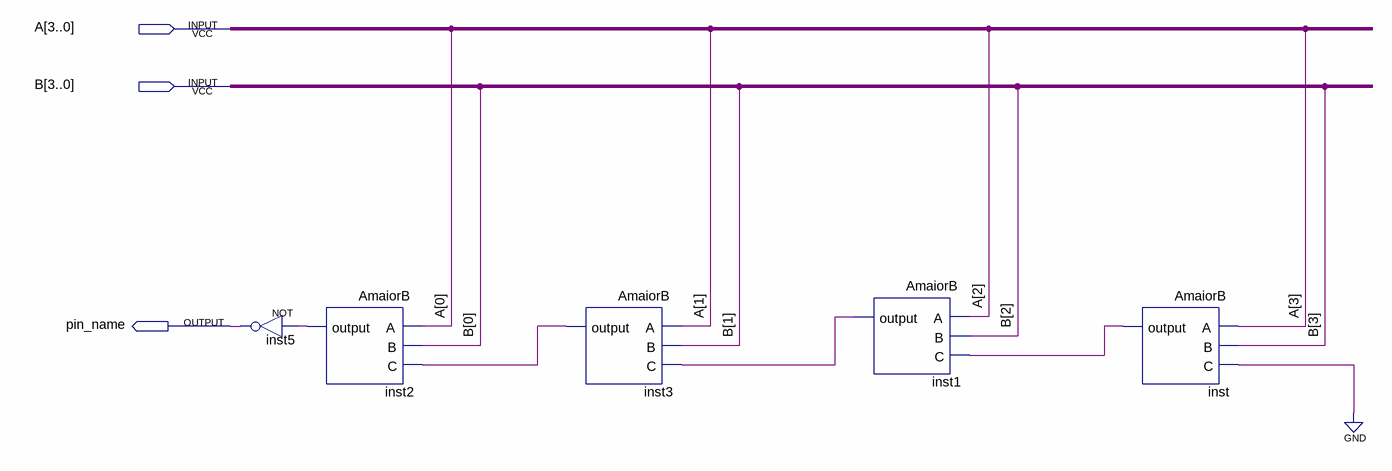
[diagram p0: schematic sheet]
// Quartus schematic AmaiorBNOT4Bits.bdf as structural Verilog: 5 symbols, 3 pins
module AmaiorBNOT4Bits (
  input  [3:0] A,
  input  [3:0] B,
  output pin_name
);

  wire inst1_output, inst2_output, inst3_output, inst_output;

  not inst5 (pin_name, inst2_output);
  AmaiorB inst2 (.A(A[0]), .B(B[0]), .C(inst3_output), .\output (inst2_output));
  AmaiorB inst3 (.A(A[1]), .B(B[1]), .C(inst1_output), .\output (inst3_output));
  AmaiorB inst1 (.A(A[2]), .B(B[2]), .C(inst_output), .\output (inst1_output));
  AmaiorB inst (.A(A[3]), .B(B[3]), .C(1'b0), .\output (inst_output));
endmodule
